# Altium project RP2040 and ESP32.PrjPcb
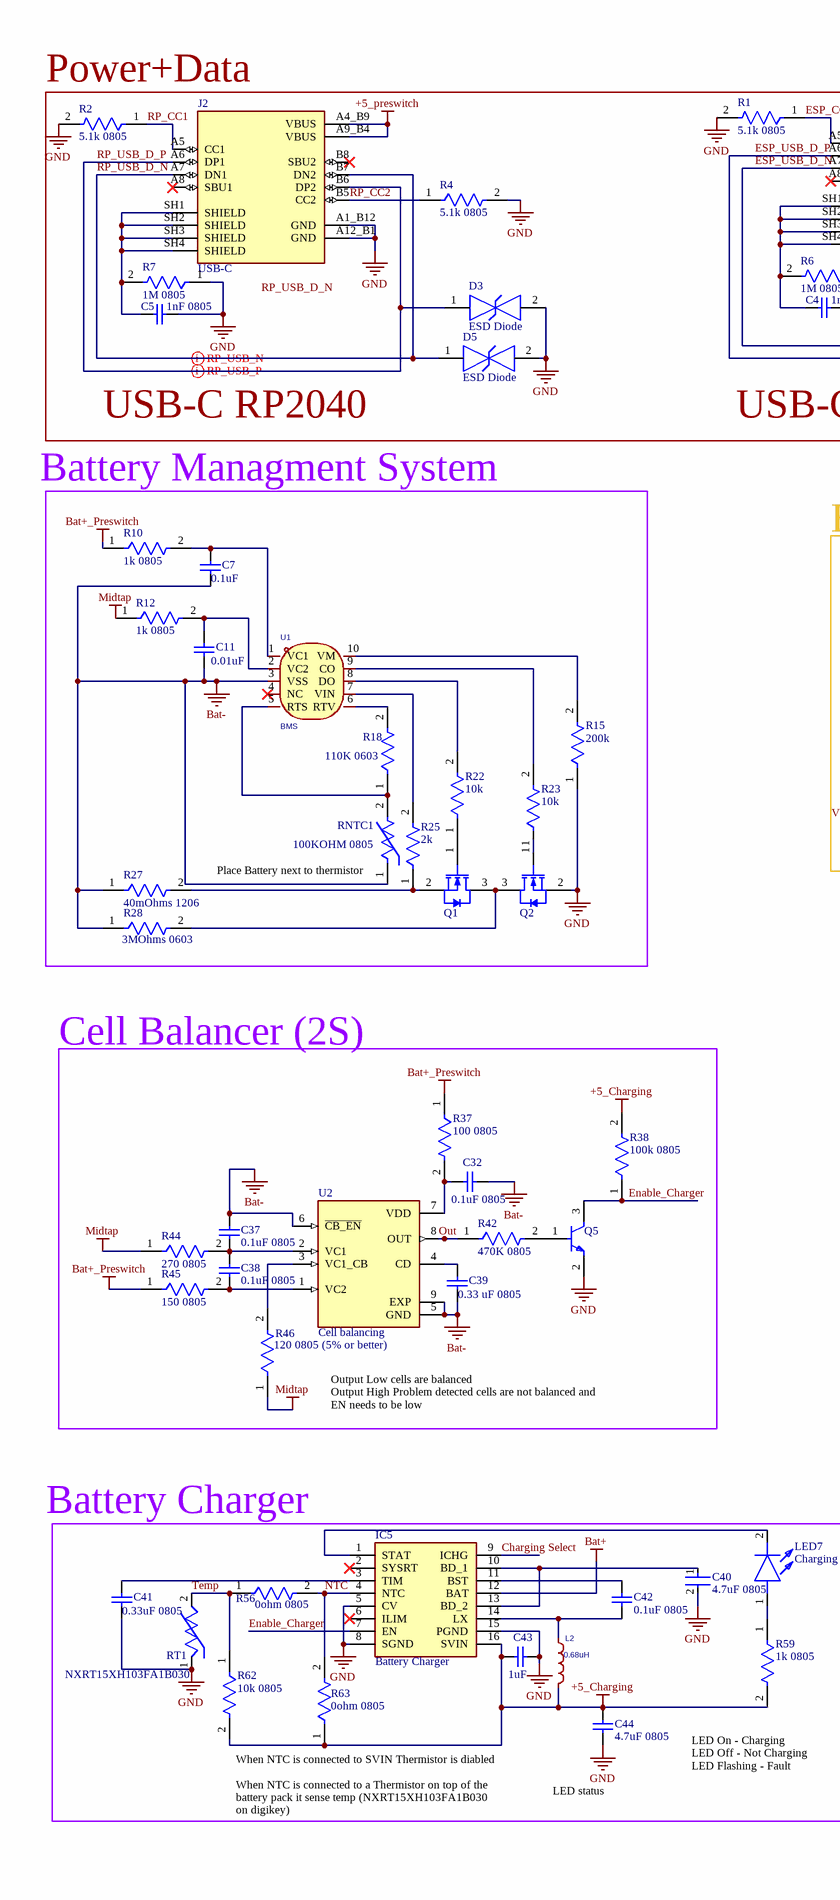
[diagram p0: Sheet1.SchDoc, left]
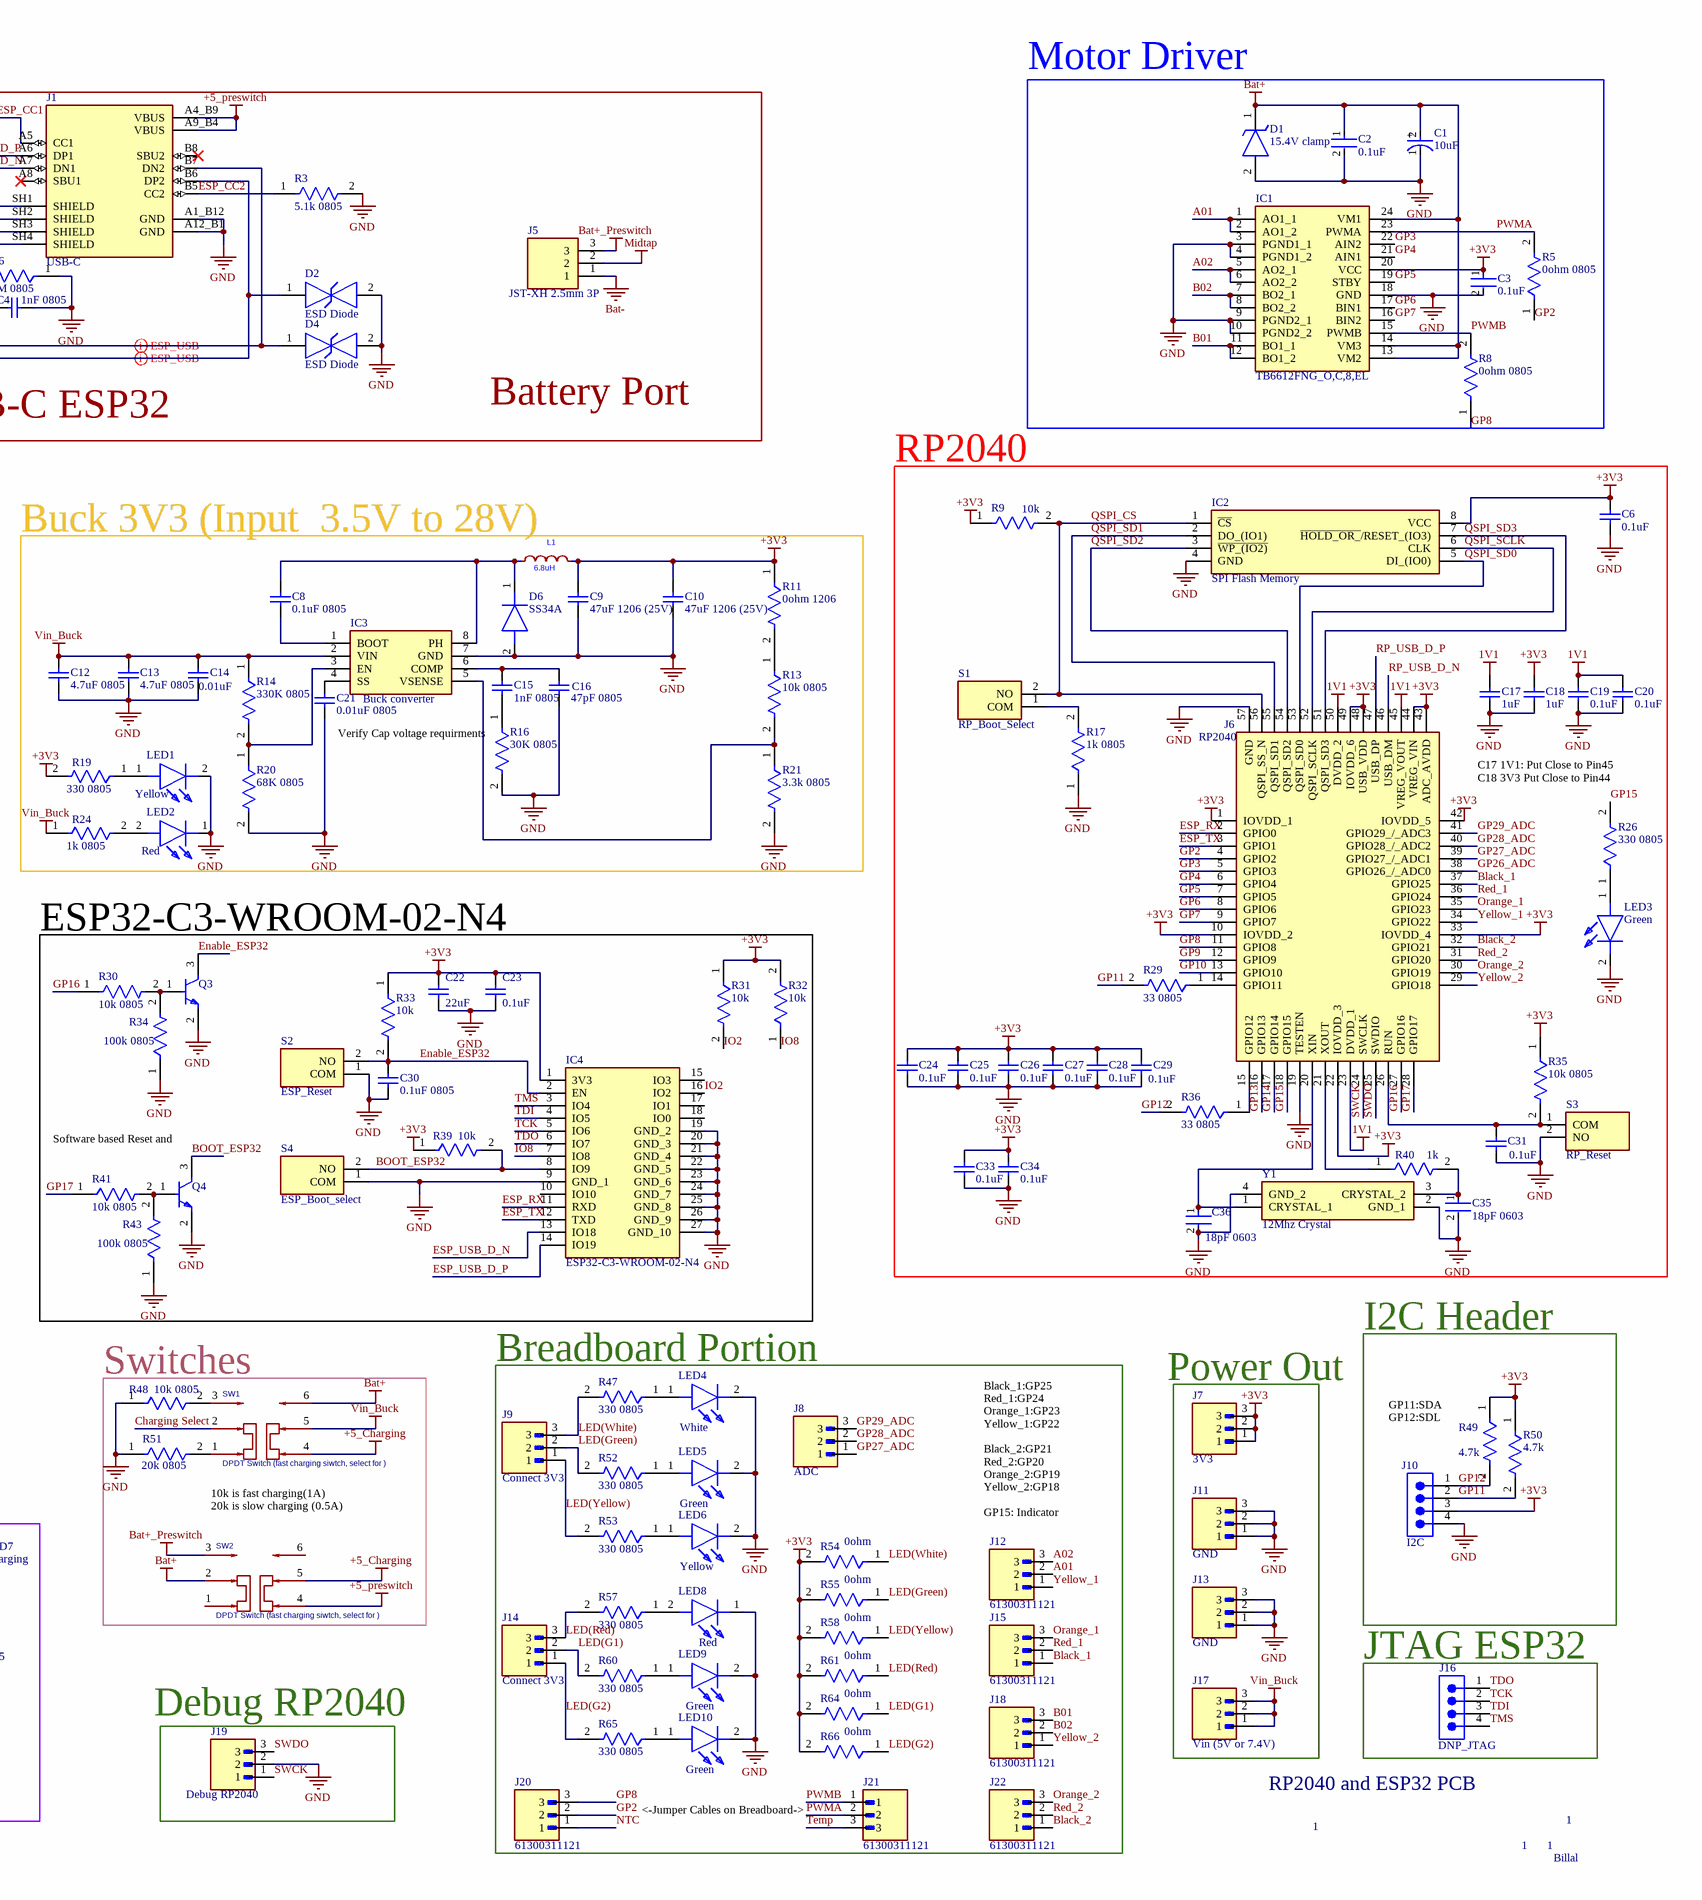
[diagram p1: Sheet1.SchDoc, right]
1 sheet, 169 parts. Net scope: global (net labels, ports and power ports of the same name join across sheets).
Board file: PCB1.PcbDoc

## Sheet Sheet1.SchDoc
size C; SheetNumber: 1; SheetTotal: 1

### Parts
C1  10uF  [FP-TAJA-MFG]
C2  0.1uF  [FP-CL779-IPC_C]
C3  0.1uF  [FP-CL779-IPC_C]
C4  1nF 0805  [CAPC2013X94X50LL20T25]
C5  1nF 0805  [CAPC2013X94X50LL20T25]
C6  0.1uF  [CAPC2013X94X50LL20T25]
C7  0.1uF  [CAPC2013X94X50LL20T25]
C8  0.1uF 0805  [CAPC2013X94X50LL20T25]
C9  47uF 1206 (25V)  [CAPC1206(3216)190_N]
C10  47uF 1206 (25V)  [CAPC1206(3216)190_N]
C11  0.01uF  [CAPC2013X94X50LL20T25]
C12  4.7uF 0805  [CAPC2013X94X50LL20T25]
C13  4.7uF 0805  [CAPC2013X94X50LL20T25]
C14  0.01uF  [CAPC2013X94X50LL20T25]
C15  1nF 0805  [CAPC2013X94X50LL20T25]
C16  47pF 0805  [CAPC2013X94X50LL20T25]
C17  1uF  [CAPC2013X94X50LL20T25]
C18  1uF  [CAPC2013X94X50LL20T25]
C19  0.1uF  [CAPC2013X94X50LL20T25]
C20  0.1uF  [CAPC2013X94X50LL20T25]
C21  0.01uF 0805  [CAPC2013X94X50LL20T25]
C22  22uF  [CAPC2013X94X50LL20T25]
C23  0.1uF  [CAPC2013X94X50LL20T25]
C24  0.1uF  [CAPC2013X94X50LL20T25]
C25  0.1uF  [CAPC2013X94X50LL20T25]
C26  0.1uF  [CAPC2013X94X50LL20T25]
C27  0.1uF  [CAPC2013X94X50LL20T25]
C28  0.1uF  [CAPC2013X94X50LL20T25]
C29  0.1uF  [CAPC2013X94X50LL20T25]
C30  0.1uF 0805  [CAPC2013X94X50LL20T25]
C31  0.1uF  [CAPC2013X94X50LL20T25]
C32  0.1uF 0805  [CAPC2013X94X50LL20T25]
C33  0.1uF  [CAPC2013X94X50LL20T25]
C34  0.1uF  [CAPC2013X94X50LL20T25]
C35  18pF 0603  [FP-C0603C-CF-MFG]
C36  18pF 0603  [FP-C0603C-CF-MFG]
C37  0.1uF 0805  [CAPC2013X94X50LL20T25]
C38  0.1uF 0805  [CAPC2013X94X50LL20T25]
C39  0.33 uF 0805  [CAPC2013X94X50LL20T25]
C40  4.7uF 0805  [FP-CC0805-0_85-MFG]
C41  0.33uF 0805  [CAPC2013X94X50LL20T25]
C42  0.1uF 0805  [CAPC2013X94X50LL20T25]
C43  1uF  [CAPC2013X94X50LL20T25]
C44  4.7uF 0805  [CAPC2013X94X50LL20T25]
D1  15.4V clamp  [DIOM5437X260N]
D2  ESD Diode  [FP-GG0402-MFG]
D3  ESD Diode  [FP-GG0402-MFG]
D4  ESD Diode  [FP-GG0402-MFG]
D5  ESD Diode  [FP-GG0402-MFG]
D6  SS34A  [DIOM5026X262N]
IC1  TB6612FNG_O,C,8,EL  [SOP65P760X160-24N]
IC2  SPI Flash Memory  [SOIC127P790X216-8N]
IC3  Buck converter  [SOIC127P600X175-8N]
IC4  ESP32-C3-WROOM-02-N4  [ESP32C3WROOM02N4]
IC5  Battery Charger  [SY6982CQDC]
J1  USB-C  [KINGHELM_KH-TYPE-C-16P]
J2  USB-C  [KINGHELM_KH-TYPE-C-16P]
J5  JST-XH 2.5mm 3P  [B3BXHALFSN]
J6  RP2040  [SC091413]
J7  3V3  [WURTH_61300311121]
J8  ADC  [WURTH_61300311121]
J9  Connect 3V3  [WURTH_61300311121]
J10  I2C  [SMTC-TSW-104-08-X-S]
J11  GND  [WURTH_61300311121]
J12  61300311121  [WURTH_61300311121]
J13  GND  [WURTH_61300311121]
J14  Connect 3V3  [WURTH_61300311121]
J15  61300311121  [WURTH_61300311121]
J16  DNP_JTAG  [SMTC-TSW-104-08-X-S]
J17  Vin (5V or 7.4V)  [WURTH_61300311121]
J18  61300311121  [WURTH_61300311121]
J19  Debug RP2040  [WURTH_61300311121]
J20  61300311121  [WURTH_61300311121]
J21  61300311121  [WURTH_61300311121]
J22  61300311121  [WURTH_61300311121]
L1  6.8uH  [IND-SMD_L7.0-W6.6]
L2  0.68uH  [IND-SMD_L2.5-W2.0]
LED1  Yellow  [KT0805G]
LED2  Red  [LEDC1608X70N]
LED3  Green  [KT0805G]
LED4  White  [KT0805G]
LED5  Green  [KT0805G]
LED6  Yellow  [KT0805G]
LED7  Charging  [KT0805G]
LED8  Red  [LEDC1608X70N]
LED9  Green  [KT0805G]
LED10  Green  [KT0805G]
Q1  Discharge Protection  [ONSC-SOT-23-3-318-08_V]  (value not drawn)
Q2  Charge Protection  [ONSC-SOT-23-3-318-08_V]  (value not drawn)
Q3  MMBT3904-7-F  [FP-SOT23-IPC_A]  (value not drawn)
Q4  MMBT3904-7-F  [FP-SOT23-IPC_A]  (value not drawn)
Q5  MMBT3904-7-F  [FP-SOT23-IPC_A]  (value not drawn)
R1  5.1k 0805  [FP-RN73R2A-IPC_C]
R2  5.1k 0805  [FP-RN73R2A-IPC_C]
R3  5.1k 0805  [FP-RN73R2A-IPC_C]
R4  5.1k 0805  [FP-RN73R2A-IPC_C]
R5  0ohm 0805  [FP-HCJ0805-MFG]
R6  1M 0805  [FP-RN73R2A-IPC_C]
R7  1M 0805  [FP-RN73R2A-IPC_C]
R8  0ohm 0805  [FP-HCJ0805-MFG]
R9  10k  [FP-RN73R2A-IPC_C]
R10  1k 0805  [FP-RN73R2A-IPC_C]
R11  0ohm 1206  [FP-HCJ1206-MFG]
R12  1k 0805  [FP-RN73R2A-IPC_C]
R13  10k 0805  [FP-RN73R2A-IPC_C]
R14  330K 0805  [FP-RN73R2A-IPC_C]
R15  200k  [FP-RN73R2A-IPC_C]
R16  30K 0805  [FP-RN73R2A-IPC_C]
R17  1k 0805  [FP-RN73R2A-IPC_C]
R18  110K 0603  [FP-RMCF0603-IPC_C]
R19  330 0805  [FP-RN73R2A-IPC_C]
R20  68K 0805  [FP-RN73R2A-IPC_C]
R21  3.3k 0805  [FP-RN73R2A-IPC_C]
R22  10k  [FP-RN73R2A-IPC_C]
R23  10k  [FP-RN73R2A-IPC_C]
R24  1k 0805  [FP-RN73R2A-IPC_C]
R25  2k  [FP-RN73R2A-IPC_C]
R26  330 0805  [FP-RN73R2A-IPC_C]
R27  40mOhms 1206  [FP-WSL1206-0_508-MFG]
R28  3MOhms 0603  [FP-AC0603-MFG]
R29  33 0805  [FP-RN73R2A-IPC_C]
R30  10k 0805  [FP-RN73R2A-IPC_C]
R31  10k  [FP-RN73R2A-IPC_C]
R32  10k  [FP-RN73R2A-IPC_C]
R33  10k  [FP-RN73R2A-IPC_C]
R34  100k 0805  [FP-RN73R2A-IPC_C]
R35  10k 0805  [FP-RN73R2A-IPC_C]
R36  33 0805  [FP-RN73R2A-IPC_C]
R37  100 0805  [FP-RN73R2A-IPC_C]
R38  100k 0805  [FP-RN73R2A-IPC_C]
R39  10k  [FP-RN73R2A-IPC_C]
R40  1k  [FP-RN73R2A-IPC_C]
R41  10k 0805  [FP-RN73R2A-IPC_C]
R42  470K 0805  [FP-RN73R2A-IPC_C]
R43  100k 0805  [FP-RN73R2A-IPC_C]
R44  270 0805  [FP-RN73R2A-IPC_C]
R45  150 0805  [FP-RN73R2A-IPC_C]
R46  120 0805 (5% or better)  [FP-RN73R2A-IPC_C]
R47  330 0805  [FP-RN73R2A-IPC_C]
R48  10k 0805  [FP-RN73R2A-IPC_C]
R49  4.7k  [FP-RN73R2A-IPC_C]
R50  4.7k  [FP-RN73R2A-IPC_C]
R51  20k 0805  [FP-RN73R2A-IPC_C]
R52  330 0805  [FP-RN73R2A-IPC_C]
R53  330 0805  [FP-RN73R2A-IPC_C]
R54  0ohm  [FP-HCJ1206-MFG]
R55  0ohm  [FP-HCJ1206-MFG]
R56  0ohm 0805  [FP-HCJ0805-MFG]
R57  330 0805  [FP-RN73R2A-IPC_C]
R58  0ohm  [FP-HCJ1206-MFG]
R59  1k 0805  [FP-RN73R2A-IPC_C]
R60  330 0805  [FP-RN73R2A-IPC_C]
R61  0ohm  [FP-HCJ1206-MFG]
R62  10k 0805  [FP-RN73R2A-IPC_C]
R63  0ohm 0805  [FP-HCJ0805-MFG]
R64  0ohm  [FP-HCJ1206-MFG]
R65  330 0805  [FP-RN73R2A-IPC_C]
R66  0ohm  [FP-HCJ1206-MFG]
RNTC1  100KOHM 0805  [FP-NCP21-0_2-IPC_A]
RT1  NXRT15XH103FA1B030  [THERM_NXRT15XH103FA1B030]
S1  RP_Boot_Select  [TS1088AR02016]
S2  ESP_Reset  [TS1088AR02016]
S3  RP_Reset  [TS1088AR02016]
S4  ESP_Boot_select  [TS1088AR02016]
SW1  DPDT Switch (fast charging siwtch, select for )  [PCBComponent_1 - duplicate]
SW2  DPDT Switch (fast charging siwtch, select for )  [PCBComponent_1 - duplicate]
U1  BMS  [MSOP-10_L3.0-W3.0-P0.50-LS4.9-BL - duplicate]
U2  Cell balancing  [SON65P300X300X100-9N]
Y1  12Mhz Crystal  [ABM8272T3]

### Blocks framed on the sheet
Motor Driver: C1-C3 D1 IC1 R5 R8
RP2040: C6 C17-C20 C24-C29 C31 C33-C36 IC2 J6 LED3 R9 R17 R26 R29 R35 R36 R40 S1 S3 Y1
Buck 3V3 (Input  3.5V to 28V): C8-C10 C12-C16 C21 D6 IC3 L1 LED1 LED2 R11 R13 R14 R16 R19-R21 R24
ESP32-C3-WROOM-02-N4: C22 C23 C30 IC4 Q3 Q4 R30-R34 R39 R41 R43 S2 S4
Cell Balancer (2S): C32 C37-C39 Q5 R37 R38 R42 R44-R46 U2
Breadboard Portion: J8 J9 J12 J14 J15 J18 J20-J22 LED4-LED6 LED8-LED10 R47 R52-R55 R57 R58 R60 R61 R64-R66
I2C Header: J10 R49 R50
Switches: R48 R51 SW1 SW2
JTAG ESP32: J16

### Nets
1V1: C17.1 C19.1 C20.1 J6.23(DVDD_1) J6.45(VREG_VOUT) J6.50(DVDD_2)
+3V3: C3.1 C6.1 C9.2 C10.2 C18.1 C22.1 C23.1 C24.1 C25.1 C26.1 C27.1 C28.1 C29.1 C33.1 C34.1 IC1.20(VCC) IC2.8(VCC) IC4.1(3V3) J6.1(IOVDD_1) J6.10(IOVDD_2) J6.22(IOVDD_3) J6.33(IOVDD_4) J6.42(IOVDD_5) J6.43(ADC_AVDD) J6.44(VREG_VIN) J6.48(USB_VDD) J6.49(IOVDD_6) J7.1 J7.2 J7.3 J10.3 L1.2 R9.1 R11.1 R19.2 R31.1 R32.2 R33.1 R35.1 R39.1 R49.1 R50.1 R54.2 R55.2 R58.2 R61.2 R64.2 R66.2
+5_Charging: C43.1 C44.1 IC5.16(SVIN) L2.2 R38.2 R59.2 R62.2 R63.1 SW1.4 SW2.5
+5_preswitch: J1.A4_B9(VBUS) J1.A9_B4(VBUS) J2.A4_B9(VBUS) J2.A9_B4(VBUS) SW2.4
Bat+: C1.2(A) C2.1 D1.1(K) IC1.13(VM2) IC1.14(VM3) IC1.24(VM1) IC5.12(BAT) SW1.6 SW2.2
Bat+_Preswitch: J5.3 R10.1 R37.1 R45.1 SW2.3
Bat-: C7.2 C11.2 C32.2 C37.1 C39.2 J5.1 R27.1 R28.1 RNTC1.1 U1.3(VSS) U2.5(GND) U2.6(~{CB_EN}) U2.9(EXP)
GND: C1.1(C) C2.2 C3.2 C4.1 C5.1 C6.2 C9.1 C10.1 C12.2 C13.2 C14.2 C16.2 C17.2 C18.2 C19.2 C20.2 C21.2 C22.2 C23.2 C24.2 C25.2 C26.2 C27.2 C28.2 C29.2 C30.2 C31.2 C33.2 C34.2 C35.2 C36.2 C40.2 C41.2 C43.2 C44.2 D1.2(A) D2.2(IO_2) D3.2(IO_2) D4.2(IO_2) D5.2(IO_2) D6.2(A) IC1.3(PGND1_1) IC1.4(PGND1_2) IC1.9(PGND2_1) IC1.10(PGND2_2) IC1.18(GND) IC2.4(GND) IC3.7(GND) IC4.9(GND_1) IC4.19(GND_2) IC4.20(GND_3) IC4.21(GND_4) IC4.22(GND_5) IC4.23(GND_6) IC4.24(GND_7) IC4.25(GND_8) IC4.26(GND_9) IC4.27(GND_10) IC5.5(CV) IC5.8(SGND) IC5.15(PGND) J1.A1_B12(GND) J1.A12_B1(GND) J2.A1_B12(GND) J2.A12_B1(GND) J6.19(TESTEN) J6.57(GND) J10.4 J11.1 J11.2 J11.3 J13.1 J13.2 J13.3 J19.2 LED1.2(K) LED2.1(K) LED3.2(K) LED4.2(K) LED5.2(K) LED6.2(K) LED8.1(K) LED9.2(K) LED10.2(K) Q2.2(S) Q3.2(E) Q4.2(E) Q5.2(E) R1.2 R2.2 R3.2 R4.2 R6.1 R7.1 R15.1 R16.2 R17.1 R20.2 R21.2 R34.1 R43.1 R48.1 R51.1 RT1.1 S2.1(COM) S3.2(NO) S4.1(COM) Y1.2(GND_1) Y1.4(GND_2)
Midtap: J5.2 R12.1 R44.1 R46.1
Vin_Buck: C12.1 C13.1 C14.1 IC3.2(VIN) J17.1 J17.2 J17.3 R14.1 R24.1 SW1.5
A01: IC1.1(AO1_1) IC1.2(AO1_2) J12.2
A02: IC1.5(AO2_1) IC1.6(AO2_2) J12.3
B01: IC1.11(BO1_1) IC1.12(BO1_2) J18.3
B02: IC1.7(BO2_1) IC1.8(BO2_2) J18.2
Black_1: J6.37(GPIO25) J15.1
Black_2: J6.32(GPIO21) J22.1
BOOT_ESP32: IC4.8(IO9) Q4.3(C) R39.2 S4.2(NO)
Charging Select: IC5.9(ICHG) SW1.2
Enable_Charger: IC5.7(EN) Q5.3(C) R38.1
Enable_ESP32: C30.1 IC4.2(EN) Q3.3(C) R33.2 S2.2(NO)
ESP_CC1: J1.A5(CC1) R1.1
ESP_CC2: J1.B5(CC2) R3.1
ESP_RX: IC4.11(RXD) J6.2(GPIO0)
ESP_TX: IC4.12(TXD) J6.3(GPIO1)
ESP_USB_D_N: D4.1(IO_1) IC4.13(IO18) J1.A7(DN1) J1.B7(DN2)
ESP_USB_D_P: D2.1(IO_1) IC4.14(IO19) J1.A6(DP1) J1.B6(DP2)
GP2: J6.4(GPIO2) J20.2 R5.1
GP3: IC1.22(AIN2) J6.5(GPIO3)
GP4: IC1.21(AIN1) J6.6(GPIO4)
GP5: IC1.19(STBY) J6.7(GPIO5)
GP6: IC1.17(BIN1) J6.8(GPIO6)
GP7: IC1.16(BIN2) J6.9(GPIO7)
GP8: J6.11(GPIO8) J20.3 R8.1
GP9: J6.12(GPIO9)
GP10: J6.13(GPIO10)
GP11: J10.2 R29.2 R50.2
GP12: J10.1 R36.2 R49.2
GP13: J6.16(GPIO13)
GP14: J6.17(GPIO14)
GP15: J6.18(GPIO15) R26.2
GP16: J6.27(GPIO16) R30.1
GP17: J6.28(GPIO17) R41.1
GP26_ADC: J6.38(GPIO26_/_ADC0)
GP27_ADC: J6.39(GPIO27_/_ADC1) J8.1
GP28_ADC: J6.40(GPIO28_/_ADC2) J8.2
GP29_ADC: J6.41(GPIO29_/_ADC3) J8.3
IO2: IC4.16(IO2) R31.2
IO8: IC4.7(IO8) R32.1
LED(G1): J14.2 R60.2 R64.1
LED(G2): J14.1 R65.2 R66.1
LED(Green): J9.2 R52.2 R55.1
LED(Red): J14.3 R57.2 R61.1
LED(White): J9.3 R47.2 R54.1
LED(Yellow): J9.1 R53.2 R58.1
NTC: IC5.4(NTC) J20.1 R56.2 R63.2
Orange_1: J6.35(GPIO23) J15.3
Orange_2: J6.30(GPIO19) J22.3
Out: R42.1 U2.8(OUT)
PWMA: IC1.23(PWMA) J21.2 R5.2
PWMB: IC1.15(PWMB) J21.1 R8.2
QSPI_CS: IC2.1(~{CS}) J6.56(QSPI_SS_N) R9.2 S1.2(NO)
QSPI_SCLK: IC2.6(CLK) J6.52(QSPI_SCLK)
QSPI_SD0: IC2.5(DI_(IO0)) J6.53(QSPI_SD0)
QSPI_SD1: IC2.2(DO_(IO1)) J6.55(QSPI_SD1)
QSPI_SD2: IC2.3(~{WP_(IO2)}) J6.54(QSPI_SD2)
QSPI_SD3: IC2.7(~{HOLD_OR_}/RESET_(IO3)) J6.51(QSPI_SD3)
Red_1: J6.36(GPIO24) J15.2
Red_2: J6.31(GPIO20) J22.2
RP_CC1: J2.A5(CC1) R2.1
RP_CC2: J2.B5(CC2) R4.1
RP_USB_D_N: D5.1(IO_1) J2.A7(DN1) J2.B7(DN2) J6.46(USB_DM)
RP_USB_D_P: D3.1(IO_1) J2.A6(DP1) J2.B6(DP2) J6.47(USB_DP)
SWCK: J6.24(SWCLK) J19.1
SWDO: J6.25(SWDIO) J19.3
TCK: IC4.5(IO6) J16.2
TDI: IC4.4(IO5) J16.3
TDO: IC4.6(IO7) J16.1
Temp: J21.3 R56.1 R62.1 RT1.2
TMS: IC4.3(IO4) J16.4
Yellow_1: J6.34(GPIO22) J12.1
Yellow_2: J6.29(GPIO18) J18.1
NetC4_2: C4.2 J1.SH1(SHIELD) J1.SH2(SHIELD) J1.SH3(SHIELD) J1.SH4(SHIELD) R6.2
NetC5_2: C5.2 J2.SH1(SHIELD) J2.SH2(SHIELD) J2.SH3(SHIELD) J2.SH4(SHIELD) R7.2
NetC7_1: C7.1 R10.2 U1.1(VC1)
NetC8_1: C8.1 D6.1(K) IC3.8(PH) L1.1
NetC8_2: C8.2 IC3.1(BOOT)
NetC11_1: C11.1 R12.2 U1.2(VC2)
NetC15_1: C15.1 C16.1 IC3.6(COMP)
NetC15_2: C15.2 R16.1
NetC21_1: C21.1 IC3.4(SS)
NetC31_1: C31.1 J6.26(RUN) R35.2 S3.1(COM)
NetC32_1: C32.1 R37.2 U2.7(VDD)
NetC35_1: C35.1 R40.2 Y1.3(CRYSTAL_2)
NetC36_1: C36.1 J6.20(XIN) Y1.1(CRYSTAL_1)
NetC37_2: C37.2 C38.1 R44.2 U2.2(VC1)
NetC38_2: C38.2 R45.2 U2.1(VC2)
NetC39_1: C39.1 U2.4(CD)
NetC40_1: C40.1 IC5.10(BD_1) IC5.13(BD_2)
NetC41_1: C41.1 IC5.3(TIM)
NetC42_1: C42.1 IC5.11(BST)
NetC42_2: C42.2 IC5.14(LX) L2.1
NetIC3_3: IC3.3(EN) R14.2 R20.1
NetIC3_5: IC3.5(VSENSE) R13.2 R21.1
NetIC5_1: IC5.1(STAT) LED7.2(K)
NetJ6_14: J6.14(GPIO11) R29.1
NetJ6_15: J6.15(GPIO12) R36.1
NetJ6_21: J6.21(XOUT) R40.1
NetLED1_1: LED1.1(A) R19.1
NetLED2_2: LED2.2(A) R24.2
NetLED3_1: LED3.1(A) R26.1
NetLED4_1: LED4.1(A) R47.1
NetLED5_1: LED5.1(A) R52.1
NetLED6_1: LED6.1(A) R53.1
NetLED7_1: LED7.1(A) R59.1
NetLED8_2: LED8.2(A) R57.1
NetLED9_1: LED9.1(A) R60.1
NetLED10_1: LED10.1(A) R65.1
NetQ1_1: Q1.1(G) R22.1
NetQ1_2: Q1.2(S) R25.1 R27.2
NetQ1_3: Q1.3(D) Q2.3(D) R28.2
NetQ2_1: Q2.1(G) R23.1
NetQ3_1: Q3.1(B) R30.2 R34.2
NetQ4_1: Q4.1(B) R41.2 R43.2
NetQ5_1: Q5.1(B) R42.2
NetR11_2: R11.2 R13.1
NetR15_2: R15.2 U1.10(VM)
NetR17_2: R17.2 S1.1(COM)
NetR18_1: R18.1 RNTC1.2 U1.5(RTS)
NetR18_2: R18.2 U1.6(RTV)
NetR22_2: R22.2 U1.8(DO)
NetR23_2: R23.2 U1.9(CO)
NetR25_2: R25.2 U1.7(VIN)
NetR46_2: R46.2 U2.3(VC1_CB)
NetR48_2: R48.2 SW1.3
NetR51_2: R51.2 SW1.1

Not connected (* = marked no-connect by the designer): IC4 10(IO10) 15(IO3) 17(IO1) 18(IO0); IC5 2(SYSRT)* 6(ILIM)*; J1 A8(SBU1)* B8(SBU2)*; J2 A8(SBU1)* B8(SBU2)*; SW2 1 6; U1 4(NC)*

### Layout directives
differential pair; differential pair class USB: ESP_USB_D_N, ESP_USB_D_P, RP_USB_D_N, RP_USB_D_P

### Notes on the sheet
- Power+Data
- Battery Port
- USB-C RP2040
- USB-C ESP32
- Battery Managment System
- (near R16) Verify Cap voltage requirments
- C17 1V1: Put Close to Pin45
  C18 3V3 Put Close to Pin44
- (near RNTC1) Place Battery next to thermistor
- Software based Reset and Flash
- Output Low cells are balanced
  Output High Problem detected cells are not balanced and EN needs to be low
- (near J7) Power Out
- GP11:SDA
  GP12:SDL
- (near IC5) Battery Charger
- 10k is fast charging(1A)
  20k is slow charging (0.5A)
- (near J12) Black_1:GP25
  Red_1:GP24
  Orange_1:GP23
  Yellow_1:GP22
  Black_2:GP21
  Red_2:GP20
  Orange_2:GP19
  Yellow_2:GP18
  GP15: Indicator
- (near J19) Debug RP2040
- LED status
- LED On - Charging
  LED Off - Not Charging
  LED Flashing - Fault
- RP2040 and ESP32 PCB
- When NTC is connected to SVIN Thermistor is diabled
  When NTC is connected to a Thermistor on top of the battery pack it sense temp (NXRT15XH103FA1B030 on digikey)
- <-Jumper Cables on Breadboard->
- 1
- Billal
- Labels drawn without touching a wire or pin: RP_USB_D_N
- (in symbol CMP-1661-00004-2) +

### Library data of the parts
C1 = CMP-1661-00004-2: C7171; Voltage Rating: 16V; ESR (Equivalent Series Resistance): 3R; Leakage Current: 1.6uA; Dissipation Factor: 8%; Dielectric Material: Tantalum; Polarity: Polar; Tolerance: 10%; Length: 3.2mm; Features: General Purpose; Voltage: 16V; Mount: Surface Mount; Case/Package: 1206; Number of Pins: 2; Case Code (Metric): 3216; Radiation Hardening: No; Min Operating Temperature: -55°C; Case Code (Imperial): 1206; Height - Seated (Max): 0.071inch; Lead Free: Lead Free; Termination: SMD/SMT; Width: 1.6mm; Capacitance: 10uF; Lead Pitch: 1.1mm; Max Operating Temperature: 125°C; Voltage Rating (DC): 16V; Packaging: Tape and Reel; Package Quantity: 1; REACH SVHC: No SVHC; Depth: 1.6mm; Height: 1.6mm; LCSC: C7171
C2 C3 = CMP-13271-002336-1: C307331; LCSC: C307331
C4 C5 C15 = CMP-2007-04160-1: C46653; Part Number: 08051C102KAT4A; Manufacturer: AVX Interconnect / Elco
C6-C8 C19 C20 C23-C34 C37 C38 C42 = CMP-2007-04160-1: C28233; Part Number: 08051C102KAT4A; Manufacturer: AVX Interconnect / Elco
C9 C10 = CMP-1037-05002-1: C6119973; Case-Metric: 3216; Case-EIA: 1206; Tolerance: Â±20%; Rated Voltage: 10 V; Technology: SMT; Value: 47uF; Max Thickness: 1.9 mm
C11 C14 C21 = CMP-2007-04160-1: C1710; Part Number: 08051C102KAT4A; Manufacturer: AVX Interconnect / Elco
C12 C13 C44 = CMP-2007-04160-1: C1779; Part Number: 08051C102KAT4A; Manufacturer: AVX Interconnect / Elco
C16 = CMP-2007-04160-1: C14857; Part Number: 08051C102KAT4A; Manufacturer: AVX Interconnect / Elco
C17 = CMP-2007-04160-1: C28323 / Put Close to Pin45; Part Number: 08051C102KAT4A; Manufacturer: AVX Interconnect / Elco
C18 = CMP-2007-04160-1: C28323 / Put Close to Pin44; Part Number: 08051C102KAT4A; Manufacturer: AVX Interconnect / Elco
C22 = CMP-2007-04160-1: C45783; Part Number: 08051C102KAT4A; Manufacturer: AVX Interconnect / Elco
C35 C36 = CMP-03020-027993-1: C1647; Manufacturer Part Number: C0603C180K4HACTU; Manufacturer: KEMET; Voltage Rating: 16 V; Material: Ceramic; Temperature Characteristic: X8R; Temperature Coefficient: 30ppm/°C; Tolerance: 0.1; Automotive Grade: Grade 1; ComponentLink2URL: https://api.kemet.com/component-edge/download/datasheet/C0603C100J5GACAUTO.pdf; Package: C0603C-CF; Temperature Range Low: -55°C; Capacitance: 18 pF; Lead Free: Yes; ComponentLink2Description: Datasheet; Automotive: Yes; Octopart: https://octopart.com/c0603c180k4hactu-kemet-88725221; Height: 0.87mm; Temperature: -55°C to +125°C; Temperature Range High: +125°C; Device Class L1: Passive Components; Device Class L3: Ceramic Capacitors; Category: Cap; RoHS: TRUE; Value: 18 pF; Device Class L2: Capacitors
C39 C41 = CMP-2007-04160-1: C1740; Part Number: 08051C102KAT4A; Manufacturer: AVX Interconnect / Elco
C40 = CMP-03422-000966-1: C1779; Manufacturer: Yageo; Manufacturer Part Number: CC0805KKX5R9BB475; Tolerance: 0.1; Voltage Rating: 50 V; Material: Ceramic; Temperature Characteristic: X5R; Capacitance: 4.7 uF; Value: 4.7 uF; Height: 0.95mm; Category: Cap; ComponentLink2Description: Datasheet; Lead Free: Yes; Device Class L2: Capacitors; Temperature Range High: +85°C; ComponentLink2URL: http://www.yageo.com/documents/recent/UPY-GPHC_Y5V_6.3V-to-50V_8.pdf; Ipc Land Pattern Name: CAPC200125X85; Octopart: https://octopart.com/cc0805kkx5r9bb475-yageo-81932641; Temperature Range Low: -30°C; Digikey Description: CAP CER 4.7UF 50V X5R 0805; Package: CC0805-0.85; Device Class L1: Passive Components; RoHS: TRUE; Device Class L3: Ceramic Capacitors; Automotive: No; Temperature: -30°C to +85°C; Footprint Url: http://www.yageo.com/exep/pages/download/literatures/UPY-C_GEN_24.pdf
C43 = CMP-2007-04160-1: C28323; Part Number: 08051C102KAT4A; Manufacturer: AVX Interconnect / Elco
D1 = SMBJ9.0A: C707989; Manufacturer_Name: HY Electronic; Datasheet Link: https://www.hygroup.com.tw/upfiles/ADUpload/all_/SMBJ%20Series%20Rev-3.pdf; Height: 2.6mm; Manufacturer_Part_Number: SMBJ9.0A
D2-D5 = CMP-04587-000001-1: C10662; Manufacturer Part Number: GG040205100N2P; Manufacturer: AVX Corporation; Reverse Standoff Voltage: 5V; Number Of Channels: 1; Clamping Voltage: 12V; Peak Pulse Current: 16A; Capacitance: 10pF; Direction: Bidirectional; Value: 10pF; Breakdown Voltage: 5.5V; Peak Pulse Power: 96W; Automotive: No; ComponentLink2URL: http://datasheets.avx.com/AVX-GiGuard.pdf; Lead Free: Yes; Device Class L2: TVS Diodes; Temperature: -55°C to +125°C; Category: Diode; Octopart: https://octopart.com/gg040205100n2p-avx-81066081; Ipc Land Pattern Name: DIOC10060X50; Digikey Description: TVS DIODE 5V 12V 0402; Device Class L3: unset; ComponentLink2Description: Datasheet; Temperature Range Low: -55°C; Temperature Range High: +125°C; Device Class L1: Circuit Protection; Height: 0.55mm; Package: GG0402; RoHS: TRUE
D6 = SS34A: C8678; Manufacturer_Name: HY Electronic; Datasheet Link: https://datasheet.datasheetarchive.com/originals/distributors/Datasheets-3/DSA-43252.pdf; Height: 2.62mm; Manufacturer_Part_Number: SS34A
IC1 = TB6612FNG_O,C,8,EL: C88224; Manufacturer_Name: Toshiba; Manufacturer_Part_Number: TB6612FNG(O,C,8,EL; Datasheet Link: https://componentsearchengine.com/Datasheets/1/TB6612FNG(O,C,8,EL.pdf; Height: 1.6mm; Mouser Part Number: 757-TB6612FNGOC8EL; Mouser Price/Stock: http://www.mouser.com/Search/ProductDetail.aspx?qs=VMlqFFbv3sQEQqYF0HJbow%3d%3d; Arrow Part Number: TB6612FNG(O,C,8,EL; Arrow Price/Stock: https://www.arrow.com/en/products/tb6612fng-oc8el/toshiba
IC2 = W25Q16JVSSIQ_TR: C131025; Manufacturer_Name: Winbond; Manufacturer_Part_Number: W25Q16JVSSIQ TR; Datasheet Link: https://www.winbond.com/resource-files/w25q16jv%20spi%20revg%2003222018%20plus.pdf; Height: 2.16mm; Mouser Part Number: 454-W25Q16JVSSIQTR; Mouser Price/Stock: https://www.mouser.co.uk/ProductDetail/Winbond/W25Q16JVSSIQ-TR?qs=qSfuJ%252Bfl%2Fd6oXlsNm7Svfg%3D%3D; Arrow Part Number: W25Q16JVSSIQ TR; Arrow Price/Stock: https://www.arrow.com/en/products/w25q16jvssiqtr/winbond-electronics?utm_currency=USD&region=nac
IC3 = TPS54331D: C9865; Manufacturer_Name: Texas Instruments; Datasheet Link: http://www.ti.com/lit/gpn/tps54331; Height: 1.75mm; Manufacturer_Part_Number: TPS54331D; Mouser Part Number: 595-TPS54331D; Mouser Price/Stock: https://www.mouser.co.uk/ProductDetail/Texas-Instruments/TPS54331D?qs=QyYHynRG50pEbpiybdzwkw%3D%3D; Arrow Part Number: TPS54331D; Arrow Price/Stock: https://www.arrow.com/en/products/tps54331d/texas-instruments?utm_currency=USD&region=europe
IC4 = ESP32-C3-WROOM-02-N4: C2934560; Manufacturer_Name: Espressif Systems; Datasheet Link: https://www.mouser.ch/datasheet/2/891/Espressif_ESP32_C3_WROOM_02-2006871.pdf; Height: 3.35mm; Manufacturer_Part_Number: ESP32-C3-WROOM-02-N4; Mouser Part Number: 356-ESP32C3WROOM02N4; Mouser Price/Stock: https://www.mouser.co.uk/ProductDetail/Espressif-Systems/ESP32-C3-WROOM-02-N4?qs=stqOd1AaK7%2FqjTZKEOgfUg%3D%3D
IC5 = SY6982CQDC: C7435940; Manufacturer_Name: Silergy; Datasheet Link: https://arvidtek.com/wp-content/uploads/2025/01/2307111037_Silergy-Corp-SY6982CQDC_C7435940.pdf; Height: 0.9mm; Manufacturer_Part_Number: SY6982CQDC
J1 J2 = KH-TYPE-C-16P: C2765186; MF: kinghelm; SnapEDA_Link: https://www.snapeda.com/parts/KH-TYPE-C-16P/Kinghelm/view-part/?ref=snap; Package: None; Value: *; MP: KH-TYPE-C-16P; Check_prices: https://www.snapeda.com/parts/KH-TYPE-C-16P/Kinghelm/view-part/?ref=eda
J5 = B3B-XH-A_LF__SN_: C144394; Manufacturer_Name: JST (JAPAN SOLDERLESS TERMINALS); Manufacturer_Part_Number: B3B-XH-A(LF)(SN); Datasheet Link: https://datasheet.lcsc.com/szlcsc/1812131720_JST-Sales-America-B3B-XH-A-LF-SN_C144394.pdf; Height: 7mm; Mouser Part Number: 306-B3BXHALFSNP; Mouser Price/Stock: https://www.mouser.co.uk/ProductDetail/JST-Commercial/B3B-XH-ALFSN?qs=cdbOS8ANM9BVkoboCCIEMQ%3D%3D; Arrow Part Number: B3B-XH-A(LF)(SN); Arrow Price/Stock: https://www.arrow.com/en/products/b3b-xh-a-lf-sn/jst-manufacturing?utm_currency=USD&region=europe
J6 = SC0914_13_: C2040; Manufacturer_Name: RASPBERRY-PI; Manufacturer_Part_Number: SC0914(13); Datasheet Link: https://datasheets.raspberrypi.com/rp2040/rp2040-datasheet.pdf; Height: 0.9mm; Mouser Part Number: 358-SC091413; Mouser Price/Stock: https://www.mouser.co.uk/ProductDetail/Raspberry-Pi/SC091413?qs=T%252BzbugeAwjhr%252BUbBr3TJcw%3D%3D
J7-J9 J11-J15 J17-J22 = 61300311121: C52016391; Package: None; Price: None; Value: *; MP: 61300311121; Availability: Unavailable
J10 J16 = CMP-1024-00357-1: 0.025" SQ Post Header, Through-hole, Vertical, -55 to 125 degC, 2.54 mm Pitch, 4-Pin, Male, RoHS; Manufacturer: Samtec; PartNumber: TSW-104-08-G-S; Pitch: 2.54 mm; RoHS: True; ComponentLink3URL: http://www.samtec.com/documents/webfiles/cpdf/TSW-XXX-XX-XXX-X-XX-XXX-MKT.pdf; Mounting Technology: Through-hole; ComponentLink2URL: http://www.samtec.com/documents/webfiles/pdf/TSW_TH.PDF; ComponentLink1URL: http://www.samtec.com; ComponentLink3Description: Package Specification; PackageVersion: DM, 8/1988; ComponentLink2Description: Datasheet; PackageReference: TSW-104-08-X-S; PackageDescription: .025[0.64] SQ. Post Terminal Strip Assembly; ComponentLink1Description: Manufacturer URL; Temperature Range: -55 to 125 degC; DatasheetVersion: F-214; Orientation: Vertical
L1 = FXL0630-6R8-M: C167221; Manufacturer: cjiang(长江微电); Add into BOM: yes; Tolerance: ±20%; Current Rating: 5A; Current - Saturation(Isat): 6A; DC Resistance(DCR): 48mΩ; Type: Molded Inductor; Symbol: FXL0630-6R8-M; Device: FXL0630-6R8-M; LCSC Part Name: 6.8uH ±20% 6A; Supplier Part: C167221; Manufacturer Part: FXL0630-6R8-M; Supplier Footprint: SMD,7x6.6mm; JLCPCB Part Class: Extended Part; Datasheet: https://item.szlcsc.com/datasheet/FXL0630-6R8-M/178604.html; Supplier: LCSC; Convert to PCB: yes; Value: 6.8uH
L2 = 252012CDMCDDS-R68MC: C492726; Manufacturer: Sumida(胜美达); Add into BOM: yes; Value: 680nH; Tolerance: ±20%; Current - Saturation(Isat): 6.3A; DC Resistance(DCR): 30mΩ; Type: Molded Inductor; Symbol: 252012CDMCDDS-R68MC; Device: 252012CDMCDDS-R68MC; LCSC Part Name: 680nH ±20% 6.3A; Supplier Part: C492726; Manufacturer Part: 252012CDMCDDS-R68MC; Supplier Footprint: 1008; JLCPCB Part Class: Extended Part; Datasheet: https://item.szlcsc.com/datasheet/252012CDMCDDS-R68MC/503355.html; Supplier: LCSC; Convert to PCB: yes; Current Rating: -; Ratings: -
LED1 LED6 = KT-0805G: C2296; Manufacturer_Name: Hubei KENTO Elec; Datasheet Link: https://jlcpcb.com/api/file/downloadByFileSystemAccessId/8639582106239348736; Height: 0.95mm; Manufacturer_Part_Number: KT-0805G
LED2 LED8 = KT-0603R: C2286; Manufacturer_Name: Hubei KENTO Elec; Datasheet Link: https://datasheet.lcsc.com/szlcsc/Hubei-KENTO-Elec-KT-0603R_C2286.pdf; Height: 0.7mm; Manufacturer_Part_Number: KT-0603R; LCSC: C2286
LED3 LED5 LED7 LED9 LED10 = KT-0805G: C2297; Manufacturer_Name: Hubei KENTO Elec; Datasheet Link: https://jlcpcb.com/api/file/downloadByFileSystemAccessId/8639582106239348736; Height: 0.95mm; Manufacturer_Part_Number: KT-0805G
LED4 = KT-0805G: C34499; Manufacturer_Name: Hubei KENTO Elec; Datasheet Link: https://jlcpcb.com/api/file/downloadByFileSystemAccessId/8639582106239348736; Height: 0.95mm; Manufacturer_Part_Number: KT-0805G
Q1 Q2 = CMP-1058-00781-1: C20917; Manufacturer: On Semiconductor; PartNumber: 2N7002LT1G; Channel Polarity: N Channel; V(BR)DSS Min (V): 60; ID Max (A): 0.115; VGS Max (V): 20; Configuration: Single; VGS(th) Max (V): 2.5; Packing: Tape and Reel; ComponentLink1URL: http://www.onsemi.com/; ComponentLink3Description: Package Specification; ComponentLink3URL: http://www.onsemi.cn/pub_link/Collateral/318-08.PDF; PackageReference: SOT-23-3-318-08; RoHS: Pb-Free; ComponentLink2URL: http://www.onsemi.com/pub_link/Collateral/2N7002L-D.PDF; ComponentLink1Description: Manufacturer URL; Package Type: SOT-23-3; DatasheetVersion: Rev. 7; Mounting Technology: Surface Mount; ComponentLink2Description: Datasheet; PackageDescription: 3-Pin Small Outline Transistor, Body 2.92 x 1.3 mm, Pitch 0.95 mm; PackageVersion: Rev. AP, 11/2009
Q3-Q5 = CMP-2000-04931-2: C364310; Frequency: 300MHz; Collector Emitter Voltage (VCEO): 40V; Power Dissipation: 350mW; Element Configuration: Single; Max Power Dissipation: 300mW; Polarity: NPN; Max Collector Current: 200mA; Collector Emitter Saturation Voltage: 300mV; Number of Elements: 1; hFE Min: 100; Collector Base Voltage (VCBO): 60V; Emitter Base Voltage (VEBO): 6V; Contact Plating: Tin; Package Quantity: 3000; Max Frequency: 300MHz; REACH SVHC: No SVHC; Max Operating Temperature: 150°C; Width: 1.4mm; Voltage Rating (DC): 40V; Radiation Hardening: No; Case/Package: SOT-23; Height: 1mm; Collector Emitter Breakdown Voltage: 40V; Length: 3.05mm; Packaging: Tape and Reel; Number of Pins: 3; Min Operating Temperature: -55°C; Gain Bandwidth Product: 300MHz; Mount: Surface Mount; Weight: 0.000282oz; Continuous Collector Current: 200mA; Transition Frequency: 300MHz; Max Breakdown Voltage: 40V; Lead Free: Lead Free
R1-R4 = CMP-04015-014497-1: C27834
R5 R8 R56 R63 = CMP-26527-000104-1: C17477; Resistance: 0mR; Radiation Hardening: No; Case Code (Imperial): 0805; Number of Terminations: 2; Lead Free: Lead Free; Max Operating Temperature: 155°C; Width: 0.049inch; Case Code (Metric): 2012; Height: 0.026inch; Mount: Surface Mount; Min Operating Temperature: -55°C; Packaging: Tape and Reel; Package Quantity: 1; Termination: Wraparound; Length: 0.079inch; RoHS Compliant: Yes; Case/Package: 0805
R6 R7 = CMP-04015-014497-1: C17514
R9 R13 R22 R23 R30-R33 R35 R39 R41 R48 R62 = CMP-04015-014497-1: C17414
R10 R12 R17 R24 R40 R59 = CMP-04015-014497-1: C1015
R11 R54 R55 R58 R61 R64 R66 = CMP-26527-002752-1: C17888; Resistance: 0mR; Radiation Hardening: No; Features: Automotive AEC-Q200; RoHS Compliant: Yes; Height: 0.026inch; Case Code (Metric): 3216; Min Operating Temperature: -55°C; Number of Terminations: 2; Mount: Surface Mount; Case/Package: 1206; Termination: Wraparound; Length: 0.122inch; Packaging: Tape and Reel; Max Operating Temperature: 155°C; Case Code (Imperial): 1206; Package Quantity: 5000; Width: 0.061inch
R14 = CMP-04015-014497-1: C17629
R15 = CMP-04015-014497-1: C17539
R16 = CMP-04015-014497-1: C17621
R18 = CMP-26527-002287-1: C25805; Max Power Dissipation: 100mW; Temperature Coefficient: 200ppm/°C; Tolerance: 5%; Resistance: 110kR; Size Code: 0603; Lead Free: Lead Free; Case/Package: 0603; Radiation Hardening: No; Number of Terminations: 2; Max Operating Temperature: 155°C; Length: 0.061inch; RoHS Compliant: Yes; Resistor Type: Thick Film; Mount: Surface Mount; Power Rating: 100mW; Width: 0.031inch; Min Operating Temperature: -55°C; Packaging: Tape and Reel; Case Code (Imperial): 0603; Series: RMCF; Features: Automotive AEC-Q200; Contact Plating: Tin; Height: 0.022inch; Case Code (Metric): 1608
R19 R26 R47 R52 R53 R57 R60 R65 = CMP-04015-014497-1: C17630
R20 = CMP-04015-014497-1: C17801
R21 = CMP-04015-014497-1: C26010
R25 = CMP-04015-014497-1: C17604
R27 = CMP-2003-04359-2: C49654479; NexarPartId: 39745044; Power Rating: 250mW; Temperature Coefficient: 75ppm/°C; Tolerance: 1%; Resistance: 40mΩ; Max Power Dissipation: 500mW; Number of Pins: 1206; REACH SVHC: Unknown; Radiation Hardening: No; Width: 1.6002mm; Schedule B: 8533210045, 8533210045; Contact Plating: Tin; Number of Terminations: 2; Features: Moisture Resistant; Case Code (Imperial): 1206; Military Standard: Not; Lead Free: Lead Free; Case Code (Metric): 3216; Composition: Metal Element; Max Operating Temperature: 170°C; Termination: SMD/SMT; Min Operating Temperature: -65°C; Case/Package: 1206; Packaging: Cut Tape; Height: 635µm; RoHS: Compliant; Depth: 1.6mm; Length: 3.2mm; Mount: Surface Mount
R28 = CMP-03412-043951-1: C23156; Power Rating: 100mW; Voltage Rating: 50V; Resistance: 3MR; Temperature Coefficient: 100ppm/°C; Tolerance: 1%; Number of Terminations: 2; Case Code (Metric): 1608; Resistor Type: Thick Film; Termination: SMD/SMT; Case/Package: 0603; RoHS Compliant: Yes; Features: Moisture Resistant; Max Power Dissipation: 100mW; Case Code (Imperial): 0603; Max Operating Temperature: 155°C; Width: 0.8mm; Packaging: Tape and Reel; Length: 0.063inch; Min Operating Temperature: -55°C; Series: AC; Height: 0.022inch
R29 R36 = CMP-04015-014497-1: C17634
R34 R38 R43 = CMP-04015-014497-1: C149504
R37 = CMP-04015-014497-1: C17408
R42 = CMP-04015-014497-1: C17709
R44 = CMP-04015-014497-1: C17590
R45 = CMP-04015-014497-1: C17471
R46 = CMP-04015-014497-1: C17437
R49 R50 = CMP-04015-014497-1: C17673
R51 = CMP-04015-014497-1: C4328
RNTC1 = CMP-06022-000440-1: C338605; Accuracy: 3%; Max Power Dissipation: 200mW; Resistance: 100kR; Current Rating: 100uA; Tolerance: 5%; Package Quantity: 4000; Lead Free: Lead Free; REACH SVHC: No SVHC; Radiation Hardening: No; Case Code (Metric): 2012; Width: 1.25mm; Length: 2mm; Depth: 1.25mm; Min Operating Temperature: -40°C; Number of Pins: 2; Power Rating: 200mW; Height: 0.85mm; Max Operating Temperature: 125°C; Case Code (Imperial): 0805; Case/Package: 0805; Termination: SMD/SMT; Mount: Surface Mount; Packaging: Tape and Reel
RT1 = NXRT15XH103FA1B030: THERMISTOR NTC 10KOHM 3380K BEAD; MF: Murata; Package: RADIAL-2 Murata; Price: None; Value: *; SnapEDA_Link: https://www.snapeda.com/parts/NXRT15XH103FA1B030/Murata/view-part/4970536/?ref=snap; MP: NXRT15XH103FA1B030; Availability: Good; Purchase-URL: https://pricing.snapeda.com/search/part/NXRT15XH103FA1B030/?ref=eda; Check_prices: https://www.snapeda.com/parts/NXRT15XH103FA1B030/Murata/view-part/4970536/?ref=eda
S1-S4 = TS-1088-AR02016: C720477; Manufacturer_Name: XUNPU; Datasheet Link: https://www.xunpudianzi.com/uploads/pdf/TS-1088-ARXXX.pdf; Height: 2mm; Manufacturer_Part_Number: TS-1088-AR02016
SW1 SW2 = SS-22F32-G060: C2848931; Manufacturer: G-Switch(品赞); Add into BOM: yes; Actuator Style: Rectangular Columnar; Switch Height: 13mm; Actuator Color: Black; Current Rating: 1A; Voltage Rating: 24V; Life: 10,000 Cycles; Symbol: SS-22F32-G060; Device: SS-22F32-G060; LCSC Part Name: 柄长6mm 直插两档 滑动开关; Supplier Part: C2848931; Manufacturer Part: SS-22F32-G060; Supplier Footprint: 插件,23.2x7.5mm; JLCPCB Part Class: Extended Part; Datasheet: https://item.szlcsc.com/datasheet/SS-22F32-G060/3048280.html; Supplier: LCSC; Convert to PCB: yes; Circuit: DPDT; Termination Style: PC Pin; Length: 23.2mm; Width: 7.5mm; Mounting Type: Through Hole; Operating Temperature: -25℃~+70℃
U1 = CM1022-CA: C22446437; Manufacturer: iCM(创芯微); Add into BOM: yes; The Chip Type: Protection IC; Charging Saturation Voltage: 4.25V; End-Off Voltage: 2.5V; Type of Battery: Lithium-ion/Polymer; Number of Cells: 2; Battery Temperature Detection: Support; Supply Current (Iq): 5uA; Symbol: CM1022-CA; Device: CM1022-CA; LCSC Part Name: 2节,带温度保护; Supplier Part: C22446437; Manufacturer Part: CM1022-CA; Supplier Footprint: MSOP-10; JLCPCB Part Class: Extended Part; Datasheet: https://item.szlcsc.com/datasheet/CM1022-CA/24098222.html; Supplier: LCSC; Convert to PCB: yes; Operating Temperature: -40℃~+85℃
U2 = BQ29209DRBR: C139352; MF: Texas Instruments; SnapEDA_Link: https://www.snapeda.com/parts/BQ29209DRBR/Texas+Instruments/view-part/?ref=snap; Package: VSON-8 Texas Instruments; Value: *; MP: BQ29209DRBR; Check_prices: https://www.snapeda.com/parts/BQ29209DRBR/Texas+Instruments/view-part/?ref=eda
Y1 = ABM8-272-T3: C20625731; Manufacturer_Name: ABRACON; Datasheet Link: https://abracon.com/datasheets/ABM8-272-T3.pdf; Height: 0.8mm; Manufacturer_Part_Number: ABM8-272-T3; Mouser Part Number: 815-ABM8-272-T3; Mouser Price/Stock: https://www.mouser.co.uk/ProductDetail/ABRACON/ABM8-272-T3?qs=QpmGXVUTftEj6miOiJBMxQ%3D%3D